# EAGLE design Battery Protection Board (EAGLE 6.5.0)
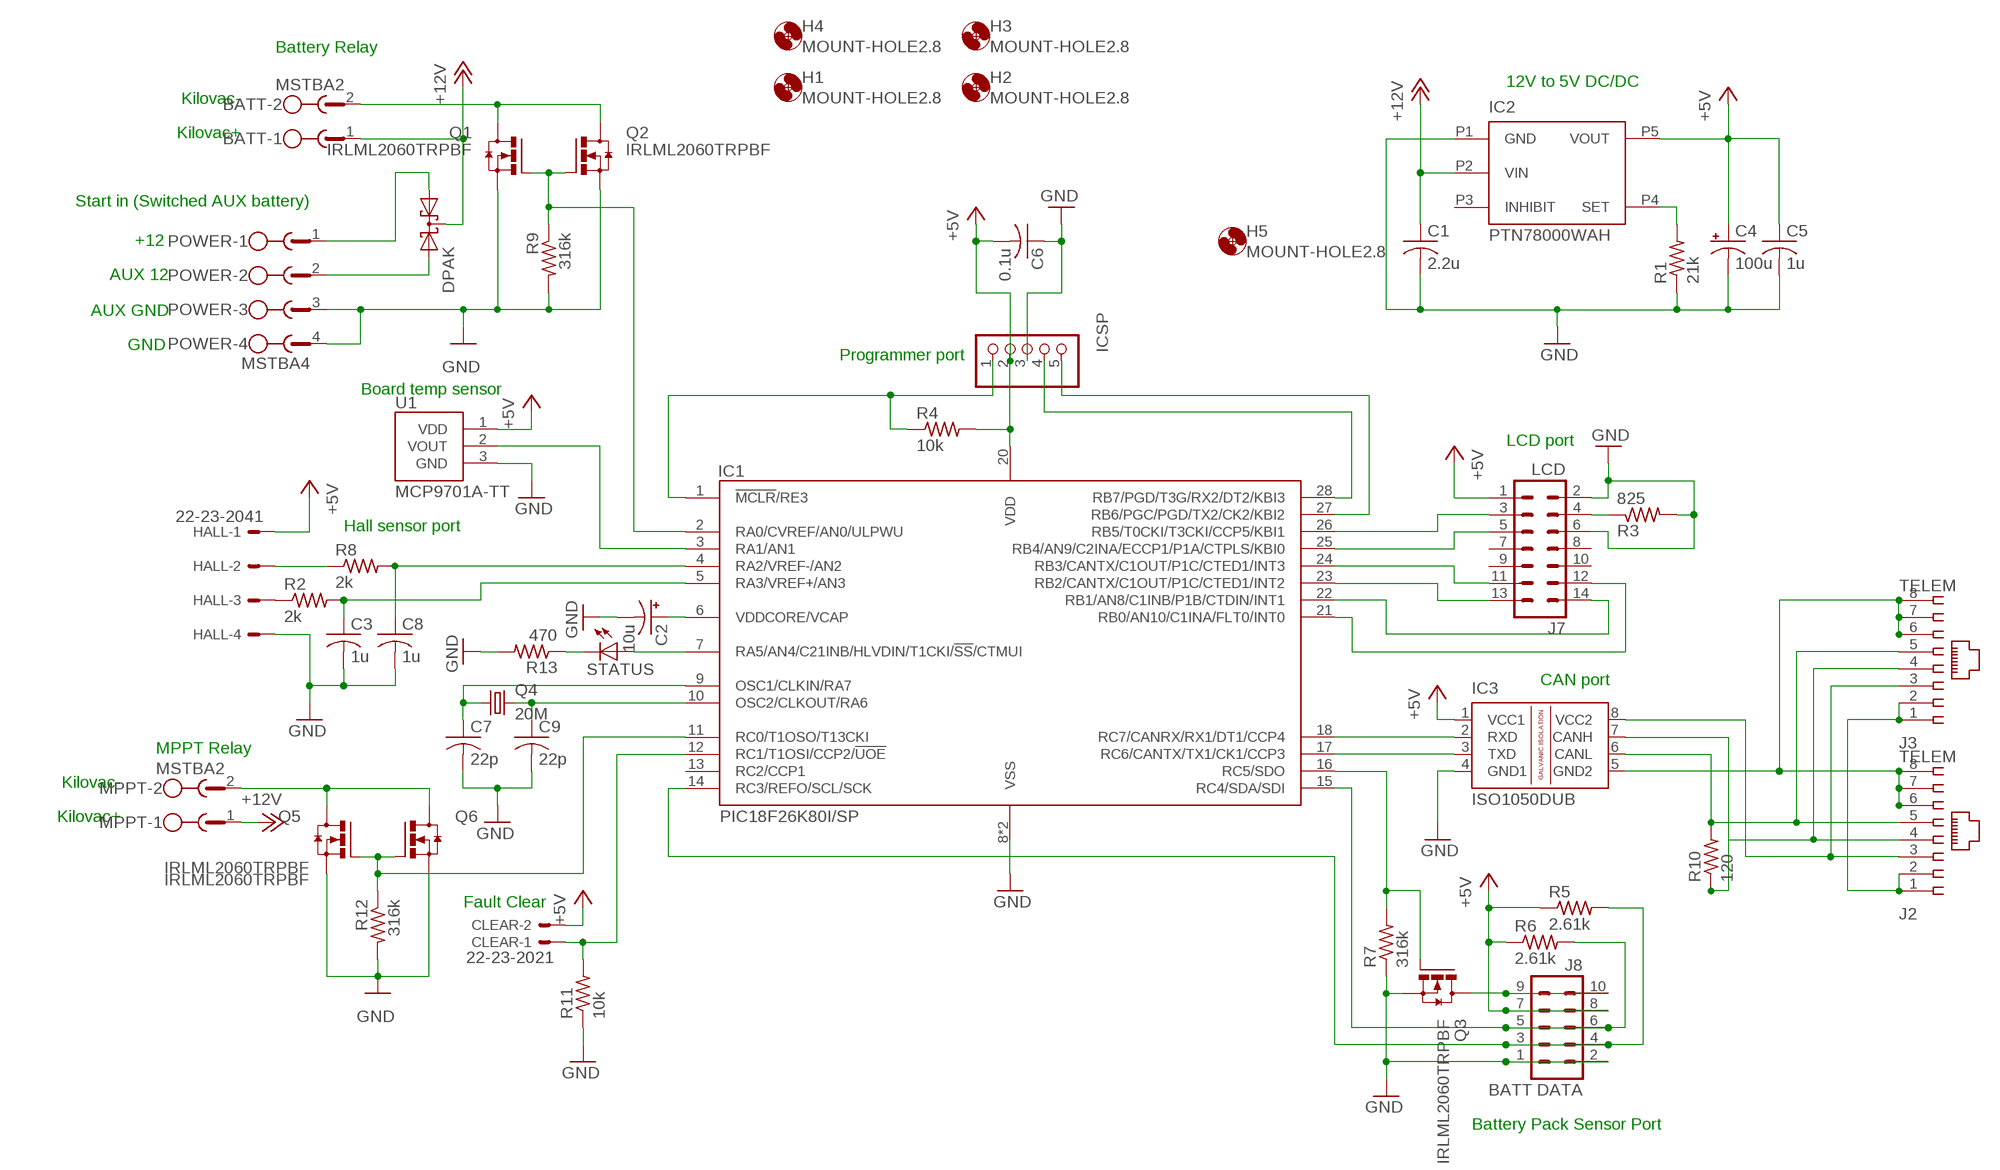
[diagram p0: schematic, sheet 1]

## Parts
BATT  MSTBA2  [MSTBA2]
C1  2.2u  C-USC1206  [C1206]
C2  10u  CPOL-USTT2D4  [TT2D4]
C3  1u  C-USC0805  [C0805]
C4  100u  CPOL-USSMCD  [SMC_D]
C5  1u  C-USC0805  [C0805]
C6  0.1u  C-USC0805  [C0805]
C7  22p  C-USC0805  [C0805]
C8  1u  C-USC0805  [C0805]
C9  22p  C-USC0805  [C0805]
CLEAR  22-23-2021  [22-23-2021]
DPAK  DIODE_2SCHOTTKY-DPAK  [DPAK]
H1  MOUNT-HOLE2.8  [2,8]
H2  MOUNT-HOLE2.8  [2,8]
H3  MOUNT-HOLE2.8  [2,8]
H4  MOUNT-HOLE2.8  [2,8]
H5  MOUNT-HOLE2.8  [2,8]
HALL  22-23-2041  [22-23-2041]
IC1  PIC18F26K80I/SP  [DIL28/3]
IC2  PTN78000WAH  [PTN78000]
IC3  ISO1050DUB  [DUB-R-PDSO-G8]
ICSP  ICD  PINHD-1X5  [1X05]
J2  TELEM  215877-7  [215877-7]
J3  TELEM  215877-7  [215877-7]
J7  LCD  ML14  [ML14]
J8  BATT DATA  ML10  [ML10]
MPPT  MSTBA2  [MSTBA2]
POWER  MSTBA4  [MSTBA4]
Q1  IRLML2060TRPBF  [SOT23]
Q2  IRLML2060TRPBF  [SOT23]
Q3  IRLML2060TRPBF  [SOT23]
Q4  20M  CRYSTALHC49S  [HC49/S]
Q5  IRLML2060TRPBF  [SOT23]
Q6  IRLML2060TRPBF  [SOT23]
R1  21k  R-US_R0805  [R0805]
R2  2k  R-US_R0805  [R0805]
R3  825  R-US_R0805  [R0805]
R4  10k  R-US_R0805  [R0805]
R5  2.61k  R-US_R0805  [R0805]
R6  2.61k  R-US_R0805  [R0805]
R7  316k  R-US_R0805  [R0805]
R8  2k  R-US_R0805  [R0805]
R9  316k  R-US_R0805  [R0805]
R10  120  R-US_0207/7  [0207/7]
R11  10k  R-US_R0805  [R0805]
R12  316k  R-US_R0805  [R0805]
R13  470  R-US_R0805  [R0805]
STATUS  LED5MM  [LED5MM]
U1  MCP9701A-TT  [SOT23]

## Nets
+5V: C4.+ C5.1 C6.2 CLEAR.2 HALL.1 IC1.20(VDD) IC2.P5(VOUT) IC3.1(VCC1) ICSP.2 J7.1 J8.7 J8.8 R4.2 R5.1 R6.1 U1.1(VDD)
+12V: BATT.1 C1.1 DPAK.3(C) IC2.P2(VIN) MPPT.1
GND: C1.2 C2.- C3.2 C4.- C5.2 C6.1 C7.2 C8.2 C9.2 HALL.4 IC1.8(VSS) IC1.19(VSS) IC2.P1(GND) IC3.4(GND1) ICSP.3 J7.2 J7.6 J8.1 J8.2 POWER.3 POWER.4 Q1.2(S) Q2.2(S) Q3.2(S) Q5.2(S) Q6.2(S) R1.1 R3.2 R7.1 R9.2 R11.1 R12.2 R13.2 U1.3(GND)
N$1: IC1.27(RB6/PGC/PGD/TX2/CK2/KBI2) ICSP.5
N$2: J7.4 R3.1
N$3: IC1.15(RC4/SDA/SDI) J8.5 J8.6 R6.2
N$4: IC1.16(RC5/SDO) Q3.1(G) R7.2
N$5: C2.+ IC1.6(VDDCORE/VCAP)
N$6: IC1.3(RA1/AN1) U1.2(VOUT)
N$7: J8.9 J8.10 Q3.3(D)
N$8: IC2.P4(SET) R1.2
N$9: IC1.7(RA5/AN4/C21INB/HLVDIN/T1CKI/!SS!/CTMUI) STATUS.A
N$10: IC1.14(RC3/REFO/SCL/SCK) J8.3 J8.4 R5.2
N$11: IC1.17(RC6/CANTX/TX1/CK1/CCP3) IC3.3(TXD)
N$12: DPAK.2(A2) POWER.2
N$13: DPAK.1(A1) POWER.1
N$14: IC3.7(CANH) J2.4 J3.4 R10.1
N$15: IC3.8(VCC2) J2.3 J3.3
N$16: J2.1 J2.2 J3.1 J3.2
N$17: IC1.22(RB1/AN8/C1INB/P1B/CTDIN/INT1) J7.14
N$18: IC1.18(RC7/CANRX/RX1/DT1/CCP4) IC3.2(RXD)
N$19: IC1.21(RB0/AN10/C1INA/FLT0/INT0) J7.12
N$20: IC1.1(!MCLR!/RE3) ICSP.1 R4.1
N$21: IC1.28(RB7/PGD/T3G/RX2/DT2/KBI3) ICSP.4
N$22: IC1.23(RB2/CANTX/C1OUT/P1C/CTED1/INT2) J7.13
N$23: IC1.24(RB3/CANTX/C1OUT/P1C/CTED1/INT3) J7.11
N$24: C7.1 IC1.9(OSC1/CLKIN/RA7) Q4.1
N$25: C9.1 IC1.10(OSC2/CLKOUT/RA6) Q4.2
N$26: IC1.25(RB4/AN9/C2INA/ECCP1/P1A/CTPLS/KBI0) J7.5
N$27: C8.1 IC1.4(RA2/VREF-/AN2) R8.2
N$28: IC1.26(RB5/T0CKI/T3CKI/CCP5/KBI1) J7.3
N$29: IC1.2(RA0/CVREF/AN0/ULPWU) Q1.1(G) Q2.1(G) R9.1
N$30: R13.1 STATUS.K(C)
N$31: C3.1 IC1.5(RA3/VREF+/AN3) R2.2
N$32: IC3.5(GND2) J2.6 J2.7 J2.8 J3.6 J3.7 J3.8
N$34: HALL.3 R2.1
N$36: IC1.11(RC0/T1OSO/T13CKI) Q5.1(G) Q6.1(G) R12.1
N$38: HALL.2 R8.1
N$39: BATT.2 Q1.3(D) Q2.3(D)
N$41: MPPT.2 Q5.3(D) Q6.3(D)
N$42: CLEAR.1 IC1.12(RC1/T1OSI/CCP2/!UOE!) R11.2
N$58: IC3.6(CANL) J2.5 J3.5 R10.2
Unconnected: IC1.13(RC2/CCP1) IC2.P3(INHIBIT) J7.7 J7.8 J7.9 J7.10

## Notes on the sheet
- Battery Relay
- 12V to 5V DC/DC
- Kilovac-
- Kilovac+
- Start in (Switched AUX battery)
- +12
- AUX 12
- AUX GND
- GND
- Programmer port
- Board temp sensor
- LCD port
- Hall sensor port
- CAN port
- MPPT Relay
- Kilovac-
- Kilovac+
- Fault Clear
- Battery Pack Sensor Port

## Library data of the parts
BATT MPPT = con-phoenix-508:MSTBA2: PHOENIX; MF: FARNELL; MPN: 1757242; OC_FARNELL: 3705171; OC_NEWARK: 71C4161
C1 C3 C5-C9 = rcl:C-US: CAPACITOR, American symbol
C2 C4 = rcl:CPOL-US: POLARIZED CAPACITOR, American symbol
CLEAR = con-molex:22-23-2021: .100" (2.54mm) Center Header - 2 Pin; MF: MOLEX; MPN: 22-23-2021; OC_FARNELL: 1462926; OC_NEWARK: 25C3832
DPAK = MSCP_2011_v2:DIODE_2SCHOTTKY-
H1-H5 = holes:MOUNT-HOLE: MOUNTING HOLE with drill center marker
HALL = con-molex:22-23-2041: .100" (2.54mm) Center Header - 4 Pin; MF: MOLEX; MPN: 22-23-2041; OC_FARNELL: 1462920; OC_NEWARK: 38C0355
IC1 = MSCP_2011_v2:PIC18F26K80
IC2 = MSCP_2011_v1:PTN78000WAH
IC3 = texas:ISO1050: ISOLATED CAN TRANSCEIVER Source: http://focus.ti.com/lit/ds/symlink/iso1050.pdf; MPN: ISO1050DUBR; OC_FARNELL: 1755712; OC_NEWARK: 14R9899
ICSP = pinhead:PINHD-1X5: PIN HEADER
J2 J3 = con-amp:215877-7: AMP connector
J7 = con-ml:ML14: HARTING; OC_FARNELL: unknown; OC_NEWARK: unknown
J8 = con-ml:ML10: HARTING; OC_FARNELL: unknown; OC_NEWARK: unknown
POWER = con-phoenix-508:MSTBA4: PHOENIX; MF: FARNELL; MPN: 1757268; OC_FARNELL: 3705195; OC_NEWARK: 71C4163
Q1-Q3 Q5 Q6 = MSCP_2011_v2:IRLML2060
Q4 = crystal:CRYSTAL: CRYSTAL; OC_FARNELL: 1667008; OC_NEWARK: unknown
R1-R9 R11-R13 = rcl:R-US_: RESISTOR, American symbol
R10 = adafruit:R-US_: RESISTOR, American symbol
STATUS = adafruit:LED: LED OSRAM: - CHIPLED LG R971, LG N971, LY N971, LG Q971, LY Q971, LO R971, LY R971 LH N974, LH R974 LS Q976, LO Q976, LY Q976 LO Q996 - Hyper CHIPLED LW Q18S LB Q993, LB Q99A, LB R99A - SideLED LS A670, LO A670, LY A670, LG A670, LP A670 LB A673, LV A673, LT A673, LW A673 LH A674 LY A675 LS A676, LA A676, LO A676, LY A676, LW A676 LS A679, LY A679, LG A679 - Hyper Micro SIDELED® LS Y876, LA Y876, LO Y876, LY Y876 LT Y87S - SmartLED LW L88C, LW L88S LB L89C, LB L89S, LG L890 LS L89K, LO L89K, LY L89K LS L896, LA L896, LO L896, LY L896 - TOPLED LS T670, LO T670, LY T670, LG T670, LP T670 LSG T670, LSP T670, LSY T670, LOP T670, LYG T670 LG T671, LOG T671, LSG T671 LB T673, LV T673, LT T673, LW T673 LH T674 LS T676, LA T676, LO T676, LY T676, LB T676, LH T676, LSB T676, LW T676 LB T67C, LV T67C, LT T67C, LS T67K, LO T67K, LY T67K, LW E67C LS E67B, LA E67B, LO E67B, LY E67B, LB E67C, LV E67C, LT E67C LW T67C LS T679, LY T679, LG T679 LS T770, LO T770, LY T770, LG T770, LP T770 LB T773, LV T773, LT T773, LW T773 LH T774 LS E675, LA E675, LY E675, LS T675 LS T776, LA T776, LO T776, LY T776, LB T776 LHGB T686 LT T68C, LB T68C - Hyper Mini TOPLED® LB M676 - Mini TOPLED Santana® LG M470 LS M47K, LO M47K, LY M47K Source: http://www.osram.convergy.de/
U1 = MSCP_2011_v2:MCP9701A

## Board
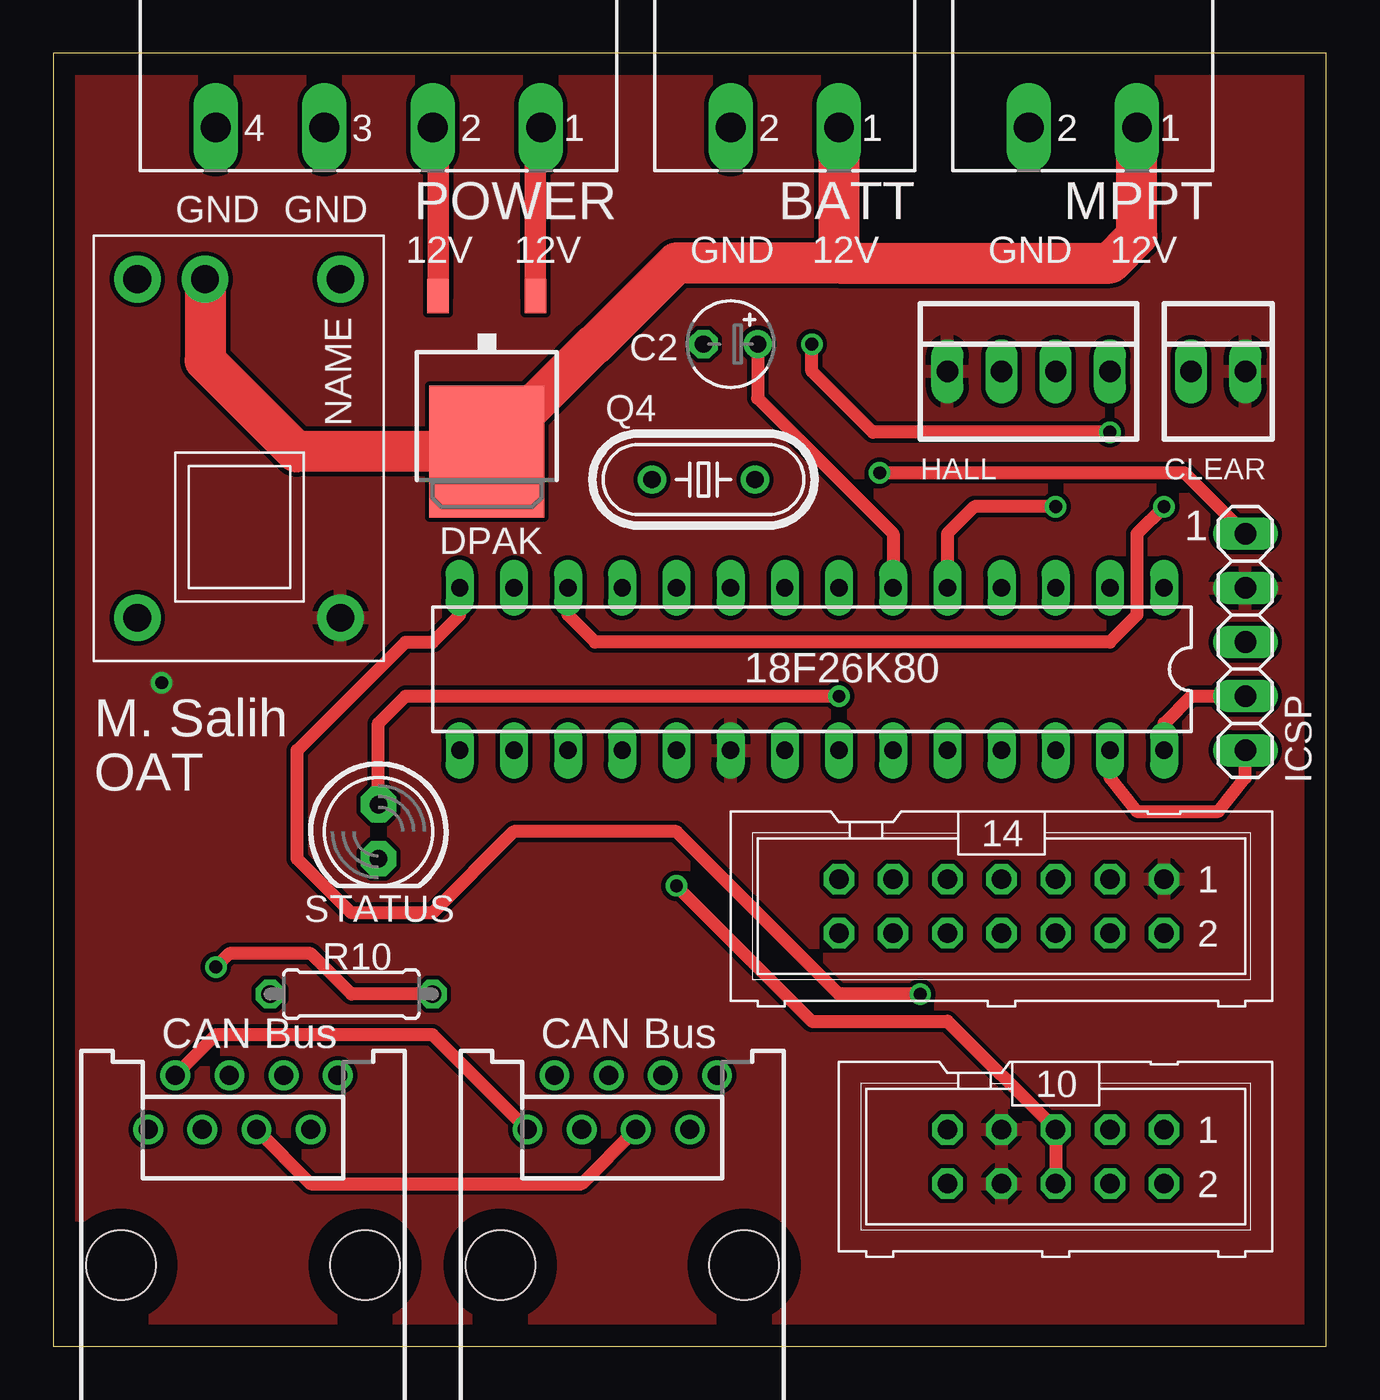
[diagram p1: board, top side]
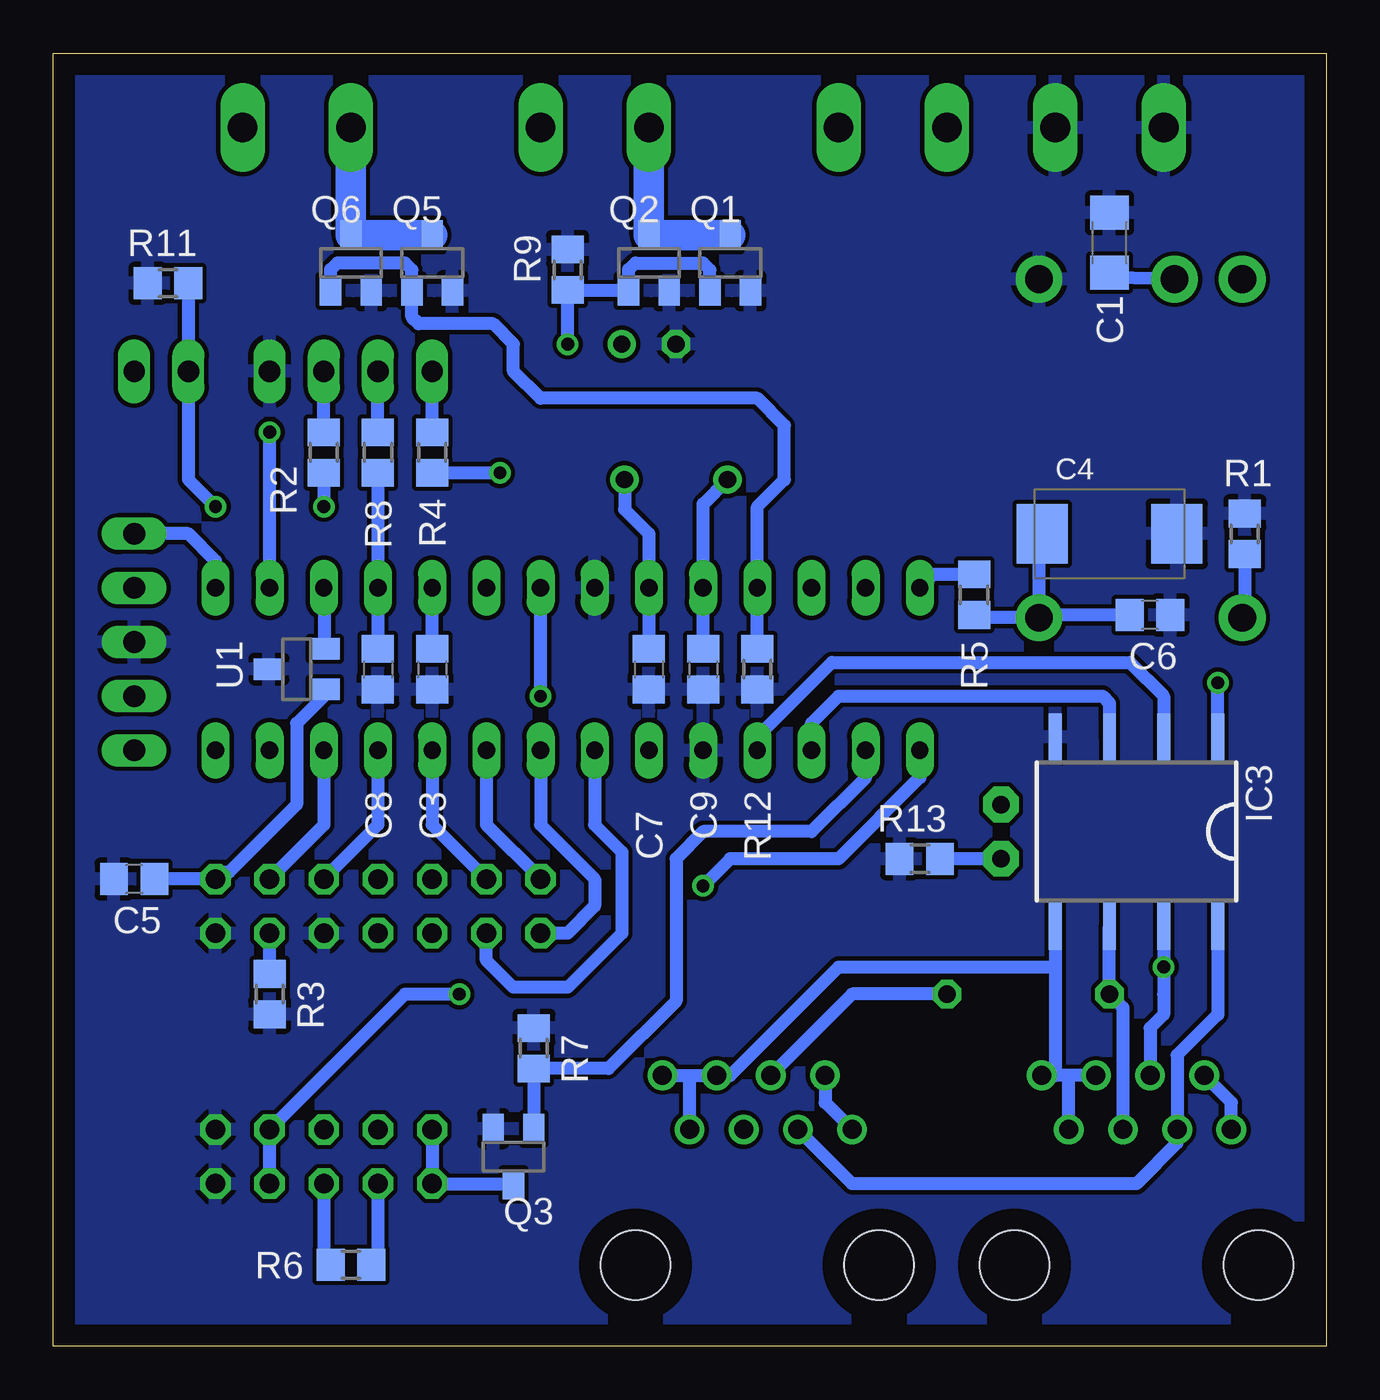
[diagram p2: board, bottom side, seen from below]

Size 59.67 x 60.63 mm. Coordinates in mm from the lower left corner, seen from the top.
Outline: 0,0 59.67,0 59.67,60.63 0,60.63 0,0
Copper layers (1*16): Top 0.035mm / dielectric 1.5mm / Bottom 0.035mm
Design rules "default": minimum track width 10mil, minimum drill 24mil, track to track 8mil, track to pad 8mil, pad to pad 8mil, via to via 8mil, smd to smd 8mil, copper to edge 40mil, drill to drill 8mil, minimum pad ring 10mil, minimum via ring 8mil, stop-mask expansion 4mil, vias tented up to drill 0mil, thermal gap 10mil

### Footprints (pad centres in the part's own frame; a part is rotated, then mirrored left to right if it is on the bottom)
MSTBA2 = drill 1.397 long: 1 -2.54,5.08; 2 2.54,5.08
C1206 = smd 1.6 x 1.8: 1 -1.4,0; 2 1.4,0
TT2D4 = drill 0.813: + -1.27,0 | drill 0.813 octagon: - 1.27,0
C0805 = smd 1.3 x 1.5: 1 -0.95,0; 2 0.95,0
SMC_D = smd 2.4 x 2.8: + -3.15,0; - 3.15,0
22-23-2021 = drill 1 long: 1 -1.27,0; 2 1.27,0
DPAK = smd 1 x 1.6: 1 -2.28,-4.8; 2 2.28,-4.8 | smd 5.4 x 6.2: 3 0,2.5
2,8 = hole 2.8: 0,0
22-23-2041 = drill 1 long: 1 -3.81,0; 2 -1.27,0; 3 1.27,0; 4 3.81,0
DIL28/3 = drill 0.813 long: 1 -16.51,-3.81; 2 -13.97,-3.81; 3 -11.43,-3.81; 4 -8.89,-3.81; 5 -6.35,-3.81; 6 -3.81,-3.81; 7 -1.27,-3.81; 8 1.27,-3.81; 9 3.81,-3.81; 10 6.35,-3.81; 11 8.89,-3.81; 12 11.43,-3.81; 13 13.97,-3.81; 14 16.51,-3.81; 15 16.51,3.81; 16 13.97,3.81; 17 11.43,3.81; 18 8.89,3.81; 19 6.35,3.81; 20 3.81,3.81; 21 1.27,3.81; 22 -1.27,3.81; 23 -3.81,3.81; 24 -6.35,3.81; 25 -8.89,3.81; 26 -11.43,3.81; 27 -13.97,3.81; 28 -16.51,3.81
PTN78000 = drill 1.3 pad 2.184: P1 -8.128,4.572; P2 -8.128,-1.778; P3 -8.128,-4.953; P4 7.747,-4.953; P5 7.747,4.572
DUB-R-PDSO-G8 = smd 0.6 x 2.2: 1 -3.81,-4.445; 2 -1.27,-4.445; 3 1.27,-4.445; 4 3.81,-4.445; 5 3.81,4.445; 6 1.27,4.445; 7 -1.27,4.445; 8 -3.81,4.445
1X05 = drill 1.016 long: 1 -5.08,0; 2 -2.54,0; 3 0,0; 4 2.54,0; 5 5.08,0
215877-7 = drill 0.889: 1 -4.445,6.35; 2 -3.175,8.89; 3 -1.905,6.35; 4 -0.635,8.89; 5 0.635,6.35; 6 1.905,8.89; 7 3.175,6.35; 8 4.445,8.89 | hole 3.251: -5.715,0; 5.715,0
ML14 = drill 0.914 octagon: 1 -7.62,-1.27; 2 -7.62,1.27; 3 -5.08,-1.27; 4 -5.08,1.27; 5 -2.54,-1.27; 6 -2.54,1.27; 7 0,-1.27; 8 0,1.27; 9 2.54,-1.27; 10 2.54,1.27; 11 5.08,-1.27; 12 5.08,1.27; 13 7.62,-1.27; 14 7.62,1.27
ML10 = drill 0.914 octagon: 1 -5.08,-1.27; 2 -5.08,1.27; 3 -2.54,-1.27; 4 -2.54,1.27; 5 0,-1.27; 6 0,1.27; 7 2.54,-1.27; 8 2.54,1.27; 9 5.08,-1.27; 10 5.08,1.27
MSTBA4 = drill 1.397 long: 1 -7.62,5.08; 2 -2.54,5.08; 3 2.54,5.08; 4 7.62,5.08
SOT23 = smd 1 x 1.4: 1 -0.95,-1.306; 2 0.95,-1.306; 3 0,1.306
HC49/S = drill 0.813: 1 -2.413,0; 2 2.413,0
R0805 = smd 1.3 x 1.5: 1 -0.95,0; 2 0.95,0
0207/7 = drill 0.813 octagon: 1 -3.81,0; 2 3.81,0
LED5MM = drill 0.813 pad 1.676 octagon: A -1.27,0; K 1.27,0

### Placement (x,y rotation side)
BATT  34.29,62.23 180 top
C1  10.16,51.75 90 bottom
C2  31.75,46.99 180 top
C3  41.91,31.75 270 bottom
C4  10.16,38.1 0 bottom
C5  55.88,21.91 180 bottom
C6  8.26,34.29 180 bottom
C7  31.75,31.75 270 bottom
C8  44.45,31.75 270 bottom
C9  29.21,31.75 270 bottom
CLEAR  54.61,45.72 0 top
DPAK  20.32,44.45 180 top
H1  -15.24,44.45 0 top  (outside the outline)
H2  -17.78,30.48 0 top  (outside the outline)
H3  -13.97,15.24 0 top  (outside the outline)
H4  71.44,60.64 0 top  (outside the outline)
H5  -10.48,55.56 0 top  (outside the outline)
HALL  45.72,45.72 0 top
IC1  35.56,31.75 180 top
IC2  8.89,41.91 270 top
IC3  8.89,24.13 180 bottom
ICSP  55.88,33.02 270 top
J2  8.89,3.81 0 top
J3  26.67,3.81 0 top
J7  44.45,20.64 180 top
J8  46.99,8.89 180 top
MPPT  48.26,62.23 180 top
POWER  15.24,62.23 180 top
Q1  27.94,50.8 0 bottom
Q2  31.75,50.8 0 bottom
Q3  38.1,8.89 180 bottom
Q4  30.48,40.64 180 top
Q5  41.91,50.8 0 bottom
Q6  45.72,50.8 0 bottom
R1  3.81,38.1 270 bottom
R2  46.99,41.91 270 bottom
R3  49.53,16.51 270 bottom
R4  41.91,41.91 90 bottom
R5  16.51,35.24 90 bottom
R6  45.72,3.81 180 bottom
R7  37.15,13.97 270 bottom
R8  44.45,41.91 270 bottom
R9  35.56,50.48 90 bottom
R10  13.97,16.51 180 top
R11  54.29,49.85 0 bottom
R12  26.67,31.75 270 bottom
R13  19.05,22.86 180 bottom
STATUS  15.24,24.13 270 top
U1  48.26,31.75 90 bottom

### Tracks (layer width: path | path; a pad name or v marks a point on that pad's centre or on a via)
+5V  (via drill 0.6)
  Bottom 0.61: R4.2 HALL.1 | C5.1 J7.1 51.75,22.23 51.43,22.23 48.26,25.4 48.26,29.21 46.95,30.52 U1.1 | IC2.P5 16.38,34.16 R5.1 | IC3.1 v5.08,31.12 | C6.2 13.34,34.29 IC2.P5 | IC2.P5 13.46,37.95 C4.+ | J8.8 44.45,4.13 R6.1
  pour Top: 0,60.96 59.69,60.96 59.69,0 0,0
+12V
  Top 1.93: 20.36,41.91 DPAK.3 | BATT.1 36.83,50.8 | 36.83,50.8 49.53,50.8 50.8,52.07 MPPT.1 | 36.83,50.8 29.21,50.8 25.4,46.99 25.36,46.99 DPAK.3 | DPAK.3 11.39,41.95 7.11,46.23 IC2.P2
  Bottom 0.61: IC2.P2 9.97,50.1 C1.1
GND
  pour Bottom: 0,60.96 59.69,60.96 59.69,0 0,0
N$1
  Top 0.61: IC1.27 49.53,26.67 50.8,25.08 54.61,25.08 55.88,26.67 ICSP.5
N$2
  Bottom 0.61: R3.1 J7.4
N$3  (via drill 0.6)
  Top 0.61: v29.21,21.59 35.56,15.24 41.91,15.24 J8.5 J8.6
  Bottom 0.61: IC1.15 19.05,26.67 22.86,22.86 27.94,22.86 v29.21,21.59 | J8.6 46.99,4.13 R6.2
N$4
  Bottom 0.61: IC1.16 21.59,26.67 24.13,24.13 29.21,24.13 30.48,22.86 30.48,16.19 33.66,13.02 R7.2 Q3.1
N$5
  Top 0.61: C2.+ 33.02,44.45 39.37,38.1 IC1.6
N$6
  Bottom 0.61: U1.2 46.95,35.52 IC1.3
N$7
  Bottom 0.61: J8.9 J8.10 41.87,7.58 Q3.3
N$8
  Bottom 0.61: R1.2 3.81,34.29 IC2.P4
N$9  (via drill 0.6)
  Top 0.61: STATUS.A 15.24,29.21 16.51,30.48 v36.83,30.48
  Bottom 0.61: v36.83,30.48 IC1.7
N$10  (via drill 0.6)
  Top 0.61: v40.64,16.51 36.83,16.51 29.21,24.13 21.59,24.13 17.78,20.32 13.97,20.32 11.43,22.86 11.43,27.94 16.51,33.02 17.78,33.02 19.05,34.29 IC1.14
  Bottom 0.61: R5.2 18.42,36.19 IC1.14 | J8.4 J8.3 43.18,16.51 v40.64,16.51
N$11
  Bottom 0.61: IC1.17 24.13,29.21 22.86,30.48 10.48,30.48 10.16,30.16 IC3.3
N$12
  Top 1.016: DPAK.2 18.04,56.89 POWER.2
N$13
  Top 1.016: DPAK.1 22.6,56.89 POWER.1
N$14  (via drill 0.6)
  Top 0.61: R10.1 13.97,16.51 12.07,18.41 8.26,18.41 v7.62,17.78
  Bottom 0.61: IC3.7 v7.62,17.78 7.62,16.51 7.62,15.56 8.26,14.92 J2.4 | R10.1 22.23,16.51 J3.4
N$15
  Bottom 0.61: IC3.8 5.08,15.56 6.98,13.65 J2.3 6.98,9.53 8.89,7.62 22.23,7.62 J3.3
N$16
  Top 0.61: J3.1 17.78,14.61 7.62,14.61 J2.2
  Bottom 0.61: J2.1 4.45,11.43 J2.2 | J3.2 23.49,11.43 J3.1
N$17
  Bottom 0.61: IC1.22 36.83,24.45 34.29,21.91 34.29,20.64 35.56,19.37 J7.14
N$18
  Bottom 0.61: IC1.18 26.67,28.57 23.18,32.07 9.21,32.07 7.62,30.48 IC3.2
N$19
  Bottom 0.61: IC1.21 34.29,24.45 33.02,23.18 33.02,19.37 35.56,16.83 38.1,16.83 39.37,18.1 J7.12
N$20  (via drill 0.6)
  Top 0.61: v38.74,40.96 53.02,40.96 ICSP.1
  Bottom 0.61: R4.1 40.01,40.96 v38.74,40.96 | IC1.1 52.07,36.83 53.34,38.1 ICSP.1
N$21
  Top 0.61: IC1.28 52.07,29.21 53.34,30.48 ICSP.4
N$22
  Bottom 0.61: IC1.23 39.37,24.45 J7.13
N$23
  Bottom 0.61: IC1.24 41.91,24.45 J7.11
N$24
  Bottom 0.61: Q4.1 32.89,39.24 31.75,38.1 IC1.9 C7.1
N$25
  Bottom 0.61: Q4.2 29.21,39.5 IC1.10 C9.1
N$26
  Bottom 0.61: IC1.25 44.45,24.45 J7.5
N$27
  Bottom 0.61: R8.2 IC1.4 C8.1
N$28
  Bottom 0.61: IC1.26 46.99,24.45 J7.3
N$29  (via drill 0.6)
  Top 0.61: v49.53,42.86 38.42,42.86 35.56,45.72 v35.56,46.99
  Bottom 0.61: Q1.1 28.89,50.48 29.21,50.8 32.38,50.8 32.7,50.49 Q2.1 35.53,49.49 R9.1 v35.56,46.99 | IC1.2 v49.53,42.86
N$30
  Bottom 0.61: STATUS.K R13.1
N$31  (via drill 0.6)
  Top 0.61: v46.99,39.37 43.18,39.37 41.91,38.1 IC1.5
  Bottom 0.61: R2.2 v46.99,39.37 | C3.1 IC1.5
N$32
  Bottom 0.61: IC3.5 12.7,17.78 | 12.7,17.78 12.7,12.7 | J2.6 12.07,12.7 | 12.07,12.7 12.7,12.7 | 12.7,12.7 J2.8 | J2.7 12.07,12.7 | J3.8 29.85,12.7 | 29.85,12.7 J3.6 27.94,12.7 22.86,17.78 12.7,17.78 | J3.7 29.85,12.7
N$34
  Bottom 0.61: R2.1 HALL.3
N$36
  Bottom 0.61: Q6.1 46.67,50.49 46.35,50.8 43.18,50.8 42.86,50.48 Q5.1 42.86,48.26 42.55,47.94 39.05,47.94 38.1,46.99 38.1,45.72 36.83,44.45 26.67,44.45 25.4,43.18 25.4,40.64 26.67,39.37 IC1.11 R12.1
N$38
  Bottom 0.61: R8.1 HALL.2
N$39
  Bottom 1.422: Q1.3 Q2.3 BATT.2
N$41
  Bottom 1.422: Q5.3 Q6.3 MPPT.2
N$42  (via drill 0.6)
  Top 0.61: v52.07,39.37 50.8,38.1 50.8,34.29 49.53,33.02 25.4,33.02 24.13,34.29 IC1.12
  Bottom 0.61: R11.2 CLEAR.1 | CLEAR.1 | CLEAR.1 53.34,40.64 v52.07,39.37
N$58
  Top 0.61: J2.5 12.07,7.62 24.77,7.62 J3.5
  Bottom 0.61: J2.5 9.52,15.88 R10.2 IC3.6

### Text on the board
tPlace: GND | GND | 12V | 12V | GND | 12V | GND | 12V | 1 | 18F26K80 | M. Salih | OAT | CAN Bus | CAN Bus